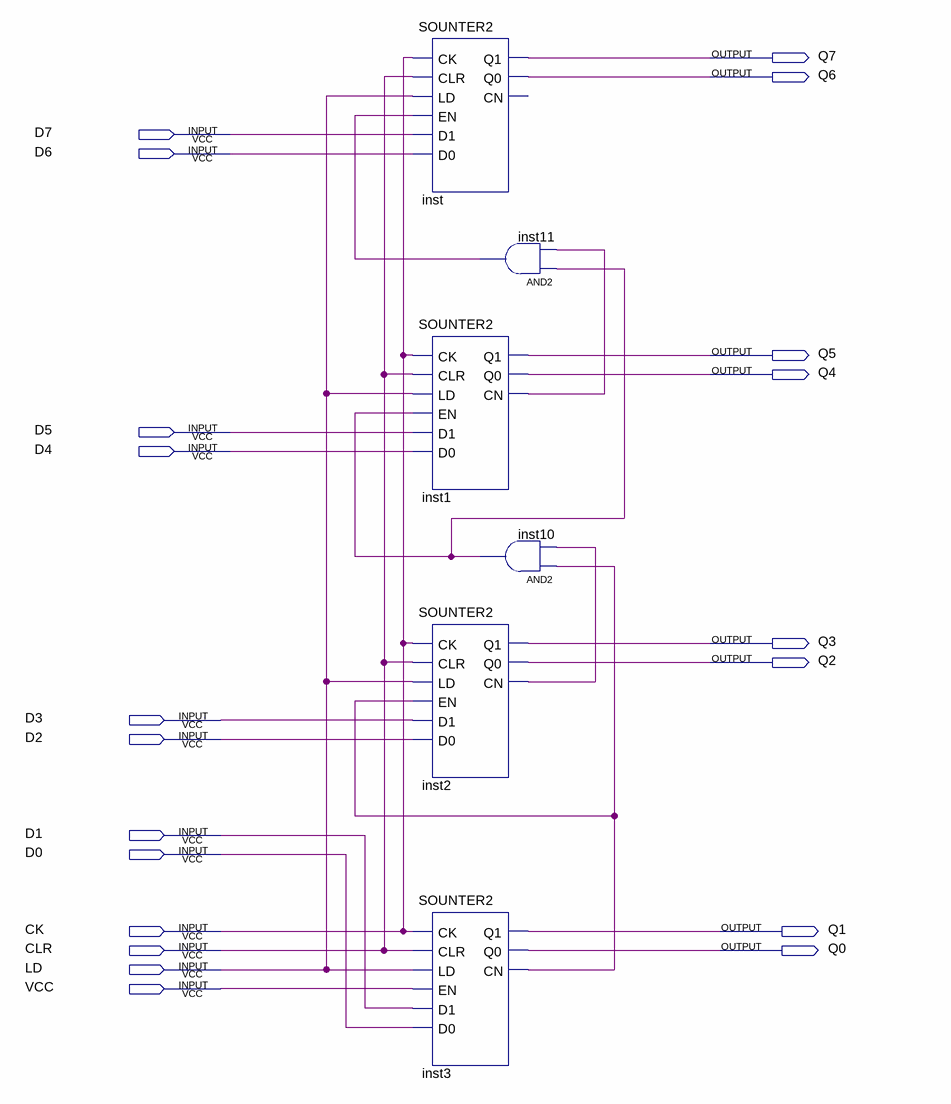
[diagram p0: schematic sheet]
// Quartus schematic MY_SCOUNTER8.bdf as structural Verilog: 6 symbols, 20 pins
module MY_SCOUNTER8 (
  input  D7,
  input  D6,
  input  D5,
  input  D4,
  input  D3,
  input  D2,
  input  D1,
  input  D0,
  input  CK,
  input  CLR,
  input  LD,
  input  VCC,
  output Q7,
  output Q6,
  output Q5,
  output Q4,
  output Q3,
  output Q2,
  output Q1,
  output Q0
);

  wire inst1_cn, inst2_cn, inst3_cn, inst10_out, inst11_out;

  SOUNTER2 inst (.CK(CK), .CLR(CLR), .LD(LD), .EN(inst11_out), .D1(D7), .D0(D6), .Q1(Q7), .Q0(Q6));  // open: CN
  SOUNTER2 inst1 (.CK(CK), .CLR(CLR), .LD(LD), .EN(inst10_out), .D1(D5), .D0(D4), .Q1(Q5), .Q0(Q4), .CN(inst1_cn));
  SOUNTER2 inst2 (.CK(CK), .CLR(CLR), .LD(LD), .EN(inst3_cn), .D1(D3), .D0(D2), .Q1(Q3), .Q0(Q2), .CN(inst2_cn));
  SOUNTER2 inst3 (.CK(CK), .CLR(CLR), .LD(LD), .EN(VCC), .D1(D1), .D0(D0), .Q1(Q1), .Q0(Q0), .CN(inst3_cn));
  and inst11 (inst11_out, inst10_out, inst1_cn);
  and inst10 (inst10_out, inst3_cn, inst2_cn);
endmodule
